# Altium project stepper.PrjPCB
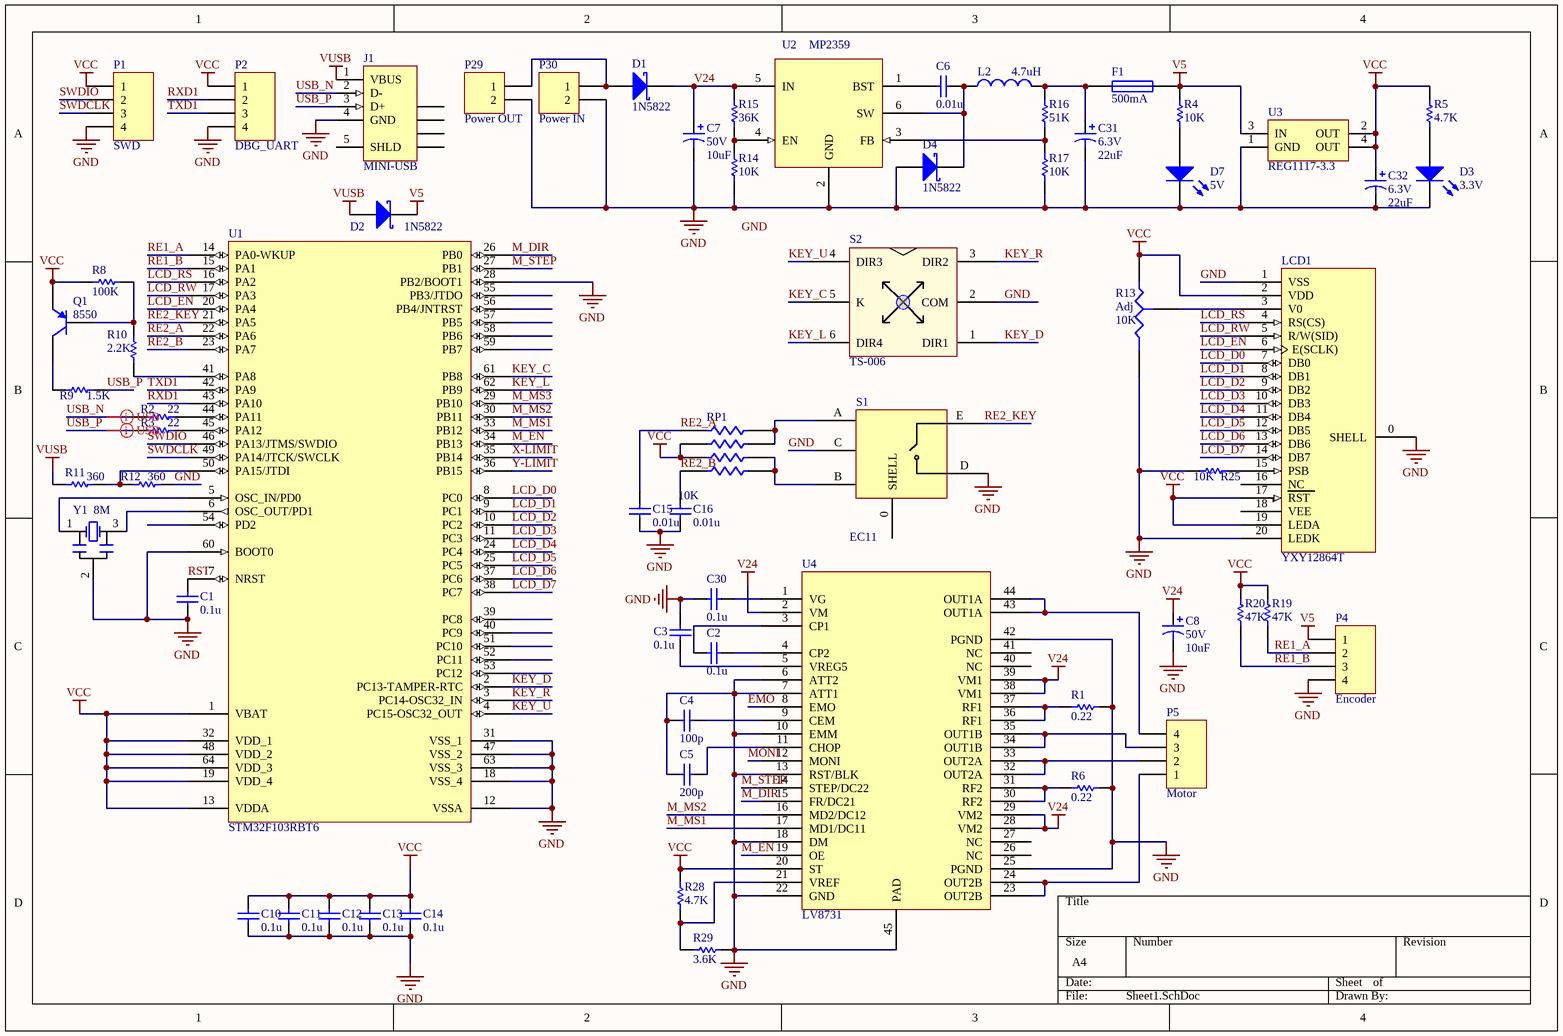
[diagram p0: Sheet1.SchDoc]
1 sheet, 63 parts. Net scope: global (net labels, ports and power ports of the same name join across sheets).
Board file: PCB1.PcbDoc

## Sheet Sheet1.SchDoc: Stepper Motor Tester
size A4

### Parts
C1  value 0.1u  [C-1608[0603]]  (hidden comment: Cap Semi)
C2  value 0.1u  [C-1608[0603]]  (hidden comment: Cap Semi)
C3  value 0.1u  [C-1608[0603]]  (hidden comment: Cap Semi)
C4  value 100p  [C-1608[0603]]  (hidden comment: Cap Semi)
C5  value 200p  [C-1608[0603]]  (hidden comment: Cap Semi)
C6  value 0.01u  [C-1608[0603]]  (hidden comment: Cap Semi)
C7  50V  value 10uF  [RB.1/.25]
C8  50V  value 10uF  [RB.1/.25]
C10  value 0.1u  [C-1608[0603]]  (hidden comment: Cap Semi)
C11  value 0.1u  [C-1608[0603]]  (hidden comment: Cap Semi)
C12  value 0.1u  [C-1608[0603]]  (hidden comment: Cap Semi)
C13  value 0.1u  [C-1608[0603]]  (hidden comment: Cap Semi)
C14  value 0.1u  [C-1608[0603]]  (hidden comment: Cap Semi)
C15  value 0.01u  [C-1608[0603]]  (hidden comment: Cap Semi)
C16  value 0.01u  [C-1608[0603]]  (hidden comment: Cap Semi)
C30  value 0.1u  [C-1608[0603]]  (hidden comment: Cap Semi)
C31  6.3V  value 22uF  [C-2012[0805]]
C32  6.3V  value 22uF  [C-2012[0805]]
D1  1N5822  [DO-214AC]
D2  1N5822  [DO-214AC]
D3  3.3V  [LED_0805_RED]
D4  1N5822  [DO-214AC]
D7  5V  [LED_0805_RED]
F1  value 500mA  [2012[0805]]
J1  MINI-USB  [Mini USB 3D]
L2  4.7uH  [L-5845]
LCD1  YXY12864T  [12864T]
P1  SWD  [HDR1X4]
P2  DBG_UART  [HDR1X4]
P4  Encoder  [HDR1X4H]
P5  Motor  [HDR1X4H]
P29  Power OUT  [DC_POWER]
P30  Power IN  [DC_POWER]
Q1  8550  [SOT23B]
R1  value 0.22  [R-6332[2512]]  (hidden comment: Res Semi)
R2  value 22  [R-1608[0603]]  (hidden comment: Res Semi)
R3  value 22  [R-1608[0603]]  (hidden comment: Res Semi)
R4  value 10K  [R-1608[0603]]  (hidden comment: Res Semi)
R5  value 4.7K  [R-1608[0603]]  (hidden comment: Res Semi)
R6  value 0.22  [R-6332[2512]]  (hidden comment: Res Semi)
R8  value 100K  [R-1608[0603]]  (hidden comment: Res Semi)
R9  value 1.5K  [R-1608[0603]]  (hidden comment: Res Semi)
R10  value 2.2K  [R-1608[0603]]  (hidden comment: Res Semi)
R11  value 360  [R-1608[0603]]  (hidden comment: Res Semi)
R12  value 360  [R-1608[0603]]  (hidden comment: Res Semi)
R13  Adj  value 10K  [HDR1X3]
R14  value 10K  [R-1608[0603]]  (hidden comment: Res Semi)
R15  value 36K  [R-1608[0603]]  (hidden comment: Res Semi)
R16  value 51K  [R-1608[0603]]  (hidden comment: Res Semi)
R17  value 10K  [R-1608[0603]]  (hidden comment: Res Semi)
R19  value 47K  [R-1608[0603]]  (hidden comment: Res Semi)
R20  value 47K  [R-1608[0603]]  (hidden comment: Res Semi)
R25  value 10K  [R-1608[0603]]  (hidden comment: Res Semi)
R28  value 4.7K  [R-1608[0603]]  (hidden comment: Res Semi)
R29  value 3.6K  [R-1608[0603]]  (hidden comment: Res Semi)
RP1  value 10K  [R0603x4]  (hidden comment: 4xRes)
S1  EC11  [EC11]
S2  TS-006  [TS-006]
U1  STM32F103RBT6  [LQFP64_N]
U2  MP2359  [SOT23-6]
U3  REG1117-3.3  [SOT223-3D]
U4  LV8731  [LV8731_V3]
Y1  8M  [Crystal_C]

### Nets
GND: C1.1 C3.2 C4.1 C5.1 C7.2 C8.2 C10.1 C11.1 C12.1 C13.1 C14.1 C15.1 C16.1 C30.2 C31.2 C32.2 D3.2(K) D4.1(A) D7.2(K) J1.4(GND) LCD1.0(SHELL) LCD1.1(VSS) LCD1.20(LEDK) P1.4 P2.4 P4.4 P29.2 P30.2 R1.1 R6.1 R12.1 R13.2(B) R14.1 R17.1 R25.2 R29.1 S1.C S1.D S2.2(COM) U1.12(VSSA) U1.18(VSS_4) U1.28(PB2/BOOT1) U1.31(VSS_1) U1.47(VSS_2) U1.60(BOOT0) U1.63(VSS_3) U2.2(GND) U3.1(GND) U4.6(ATT2) U4.7(ATT1) U4.10(EMM) U4.13(RST/BLK) U4.18(DM) U4.22(GND) U4.25(PGND) U4.42(PGND) U4.45(PAD) Y1.2(GND)
V5: D2.2(K) F1.1 P4.1 R4.2 U3.3(IN)
V24: C7.1 C8.1 D1.2(K) R15.2 U2.5(IN) U4.2(VM) U4.28(VM2) U4.29(VM2) U4.38(VM1) U4.39(VM1)
VCC: C10.2 C11.2 C12.2 C13.2 C14.2 C32.1 LCD1.2(VDD) LCD1.17(RST) LCD1.19(LEDA) P1.1 P2.1 Q1.3(E) R5.1 R8.2 R13.1(A) R19.2 R20.2 R28.2 RP1.6 RP1.7 U1.1(VBAT) U1.13(VDDA) U1.19(VDD_4) U1.32(VDD_1) U1.48(VDD_2) U1.64(VDD_3) U3.2(OUT) U3.4(OUT) U4.20(ST)
VUSB: D2.1(A) J1.1(VBUS) R11.2
EMO: U4.8(EMO)
KEY_C: S2.5(K) U1.61(PB8)
KEY_D: S2.1(DIR1) U1.2(PC13-TAMPER-RTC)
KEY_L: S2.6(DIR4) U1.62(PB9)
KEY_R: S2.3(DIR2) U1.3(PC14-OSC32_IN)
KEY_U: S2.4(DIR3) U1.4(PC15-OSC32_OUT)
LCD_D0: LCD1.7(DB0) U1.8(PC0)
LCD_D1: LCD1.8(DB1) U1.9(PC1)
LCD_D2: LCD1.9(DB2) U1.10(PC2)
LCD_D3: LCD1.10(DB3) U1.11(PC3)
LCD_D4: LCD1.11(DB4) U1.24(PC4)
LCD_D5: LCD1.12(DB5) U1.25(PC5)
LCD_D6: LCD1.13(DB6) U1.37(PC6)
LCD_D7: LCD1.14(DB7) U1.38(PC7)
LCD_EN: LCD1.6(E(SCLK)) U1.20(PA4)
LCD_RS: LCD1.4(RS(CS)) U1.16(PA2)
LCD_RW: LCD1.5(R/W(SID)) U1.17(PA3)
M_DIR: U1.26(PB0) U4.15(FR/DC21)
M_EN: U1.34(PB13) U4.19(OE)
M_MS1: U1.33(PB12) U4.17(MD1/DC11)
M_MS2: U1.30(PB11) U4.16(MD2/DC12)
M_MS3: U1.29(PB10)
M_STEP: U1.27(PB1) U4.14(STEP/DC22)
MONI: U4.12(MONI)
RE1_A: P4.2 R19.1 U1.14(PA0-WKUP)
RE1_B: P4.3 R20.1 U1.15(PA1)
RE2_A: C15.2 RP1.5 U1.22(PA6)
RE2_B: C16.2 RP1.8 U1.23(PA7)
RE2_KEY: S1.E U1.21(PA5)
RST: C1.2 U1.7(NRST)
RXD1: P2.2 U1.43(PA10)
SWDCLK: P1.3 U1.49(PA14/JTCK/SWCLK)
SWDIO: P1.2 U1.46(PA13/JTMS/SWDIO)
TXD1: P2.3 U1.42(PA9)
USB_N: J1.2(D-) R2.1
USB_P: J1.3(D+) R3.1 R9.1
X-LIMIT: U1.35(PB14)
Y-LIMIT: U1.36(PB15)
NetC2_1: C2.1 U4.4(CP2)
NetC2_2: C2.2 U4.3(CP1)
NetC3_1: C3.1 U4.5(VREG5)
NetC4_2: C4.2 U4.9(CEM)
NetC5_2: C5.2 U4.11(CHOP)
NetC6_1: C6.1 D4.2(K) L2.1 U2.6(SW)
NetC6_2: C6.2 U2.1(BST)
NetC30_1: C30.1 U4.1(VG)
NetC31_1: C31.1 F1.2 L2.2 R16.2
NetD1_1: D1.1(A) P29.1 P30.1
NetD3_1: D3.1(A) R5.2
NetD7_1: D7.1(A) R4.1
NetLCD1_3: LCD1.3(V0) R13.3(TAP)
NetLCD1_15: LCD1.15(PSB) R25.1
NetP5_1: P5.1 U4.23(OUT2B) U4.24(OUT2B)
NetP5_2: P5.2 U4.32(OUT2A) U4.33(OUT2A)
NetP5_3: P5.3 U4.34(OUT1B) U4.35(OUT1B)
NetP5_4: P5.4 U4.43(OUT1A) U4.44(OUT1A)
NetQ1_1: Q1.1(C) R9.2
NetQ1_2: Q1.2(B) R8.1 R10.2
NetR1_2: R1.2 U4.36(RF1) U4.37(RF1)
NetR2_2: R2.2 U1.44(PA11)
NetR3_2: R3.2 U1.45(PA12)
NetR6_2: R6.2 U4.30(RF2) U4.31(RF2)
NetR10_1: R10.1 U1.41(PA8)
NetR11_1: R11.1 R12.2 U1.50(PA15/JTDI)
NetR14_2: R14.2 R15.1 U2.4(EN)
NetR16_1: R16.1 R17.2 U2.3(FB)
NetR28_1: R28.1 R29.2 U4.21(VREF)
NetRP1_1: RP1.1 RP1.2 S1.B
NetRP1_3: RP1.3 RP1.4 S1.A
NetU1_5: U1.5(OSC_IN/PD0) Y1.1(OSC1)
NetU1_6: U1.6(OSC_OUT/PD1) Y1.3(OSC2)

Not connected (* = marked no-connect by the designer): J1 5(SHLD) 6(SHLD) 7(SHLD) 8(SHLD) 9(SHLD); LCD1 16(NC) 18(VEE); S1 0(SHELL); U1 39(PC8) 40(PC9) 51(PC10) 52(PC11) 53(PC12) 54(PD2) 55(PB3/JTDO) 56(PB4/JNTRST) 57(PB5) 58(PB6) 59(PB7); U4 26(NC) 27(NC) 40(NC) 41(NC)

### Layout directives
differential pair: USB_N, USB_P

### Notes on the sheet
- Labels drawn without touching a wire or pin: GND

### Library data of the parts
C1-C6 C10-C16 C30 = Cap Semi: Capacitor (Semiconductor SIM Model); Published: 8-Jun-2000; LatestRevisionDate: 17-Jul-2002; LatestRevisionNote: Re-released for DXP Platform.; PackageReference: C1206; Publisher: Altium Limited
C7 C8 = Cap Pol1: Polarized Capacitor (Radial); Published: 8-Jun-2000; LatestRevisionDate: 17-Jul-2002; LatestRevisionNote: Re-released for DXP Platform.; PackageReference: RB7.6-15; Publisher: Altium Limited
C31 C32 = Cap Pol3: Tantalum capacitor; Published: 8-Jun-2000; LatestRevisionDate: 17-Jul-2002; LatestRevisionNote: Re-released for DXP Platform.; PackageReference: C0805; Publisher: Altium Limited
D1 D4 = D Schottky: Schottky Diode; Published: 8-Jun-2000; LatestRevisionDate: 17-Jul-2002; LatestRevisionNote: Re-released for DXP Platform.; PackageReference: SMB; Publisher: Altium Limited; Code_JEDEC: DO-214-AA
D2 = D Schottky: Schottky Diode; Hint: USB Only; Published: 8-Jun-2000; LatestRevisionDate: 17-Jul-2002; LatestRevisionNote: Re-released for DXP Platform.; PackageReference: SMB; Publisher: Altium Limited; Code_JEDEC: DO-214-AA
D3 D7 = LED2: Typical RED, GREEN, YELLOW, AMBER GaAs LED; Published: 8-Jun-2000; LatestRevisionDate: 17-Jul-2002; LatestRevisionNote: Re-released for DXP Platform.; PackageDocument: Feb-2002; PackageReference: 3.2X1.6X1.1; Publisher: Altium Limited
F1 = Fuse 1: Fuse; Published: 8-Jun-2000; LatestRevisionDate: 17-Jul-2002; LatestRevisionNote: Re-released for DXP Platform.; PackageReference: PIN-W2/E2.8; Publisher: Altium Limited
J1 = 440478-1: USB 2.0, Right Angle, SMT, A Type, Receptacle, 5 Position, Black; pin to pad: 4>5 5>4; Hint: USB Only; Published: 15-Jul-2004; PackageDocument: 15-Nov-2002; PackageReference: 440478; Publisher: Altium Limited
L2 = Inductor: Published: 8-Jun-2000; LatestRevisionDate: 17-Jul-2002; LatestRevisionNote: Re-released for DXP Platform.; PackageReference: 0402-A; Publisher: Altium Limited; Value: http://item.taobao.com/item.htm?spm=a1z09.2.9.198.qSk1ut&id=37255388754&_u=9486ntt4a34
P1 P2 = Header 4: Header, 4-Pin; LatestRevisionDate: 17-Jul-2002; LatestRevisionNote: Re-released for DXP Platform.; Publisher: Altium Limited
P4 P5 = Header 4H: Header, 4-Pin, Right Angle; LatestRevisionDate: 17-Jul-2002; LatestRevisionNote: Re-released for DXP Platform.; Publisher: Altium Limited
P29 P30 = MHDR1X2: Header, 2-Pin; LatestRevisionDate: 17-Jul-2002; LatestRevisionNote: Re-released for DXP Platform.; Publisher: Altium Limited
Q1 = PNP: PNP Bipolar Transistor; pin to pad: 1>3 2>1 3>2; Hint: USB Only; Published: 8-Jun-2000; LatestRevisionDate: 17-Jul-2002; LatestRevisionNote: Re-released for DXP Platform.; PackageReference: SOT-23B; Publisher: Altium Limited; Code_JEDEC: SOT-23
R1 R4-R6 R14-R17 R19 R20 R25 R28 R29 = Res Semi: Semiconductor Resistor; Published: 8-Jun-2000; LatestRevisionDate: 17-Jul-2002; LatestRevisionNote: Re-released for DXP Platform.; PackageReference: AXIAL-0.5; Publisher: Altium Limited
R2 R3 R8-R12 = Res Semi: Semiconductor Resistor; Hint: USB Only; Published: 8-Jun-2000; LatestRevisionDate: 17-Jul-2002; LatestRevisionNote: Re-released for DXP Platform.; PackageReference: AXIAL-0.5; Publisher: Altium Limited
R13 = Res Tap: Tapped Resistor; pin to pad: 1>2 2>1; Hint: Not Fitted; Published: 24-Mar-1999; LatestRevisionDate: 17-Jul-2002; LatestRevisionNote: Re-released for DXP Platform.; PackageReference: VR3; Publisher: Altium Limited
RP1 = RPACK4
U1 = STM32F103RBT6: STM32 ARM-based 32-bit MCU High-density; Published: 30-May-2008; PackageReference: LQFP64; Publisher: Altium Limited
U2 = MP2359: 1.2A, 24V, 1.4MHz  Step-Down Converter
U3 = REG1117-3.3: 800mA and 1A Low Dropout Positive Regulator 2.85V, 3.3V, 5V, and Adjustable; Published: 8-Jun-2000; LatestRevisionDate: 17-Jul-2002; LatestRevisionNote: Re-released for DXP Platform.; PackageReference: ZZ311; Publisher: Altium Limited
Y1 = XTAL_C: Crystal Oscillator; Published: 8-Jun-2000; LatestRevisionDate: 17-Jul-2002; LatestRevisionNote: Re-released for DXP Platform.; PackageReference: R38; Publisher: Altium Limited
LCD1 = YXY12864T: Value: http://item.taobao.com/item.htm?id=40102074144
S1 = EC11: Value: http://item.taobao.com/item.htm?id=7956653770
S2 = TS-006: Value: http://www.360yuanjian.com/product/details_4076.html